# Altium schematic sheet A_D.000000.001.SchDoc: =GlobalProjectName
size 594 x 420 mm; Author: A_D; SheetTotal: 1; PageSetup: Record=PageOptions|CenterHorizontal=True|CenterVertical=True|PrintScale=0.70|XCorrection=1.00|YCorrection=1.00|PrintKind=2|BorderSize=5000000|LeftOffset=9000|BottomOffset=10100|Orientation=2|PaperLength=11176|PaperWidth=8636|Scale=100|PaperSource=259|PrintQuality=-3|MediaType=1|DitherType=10|PrintScaleMode=1|PaperKind=A3|PaperIndex=8
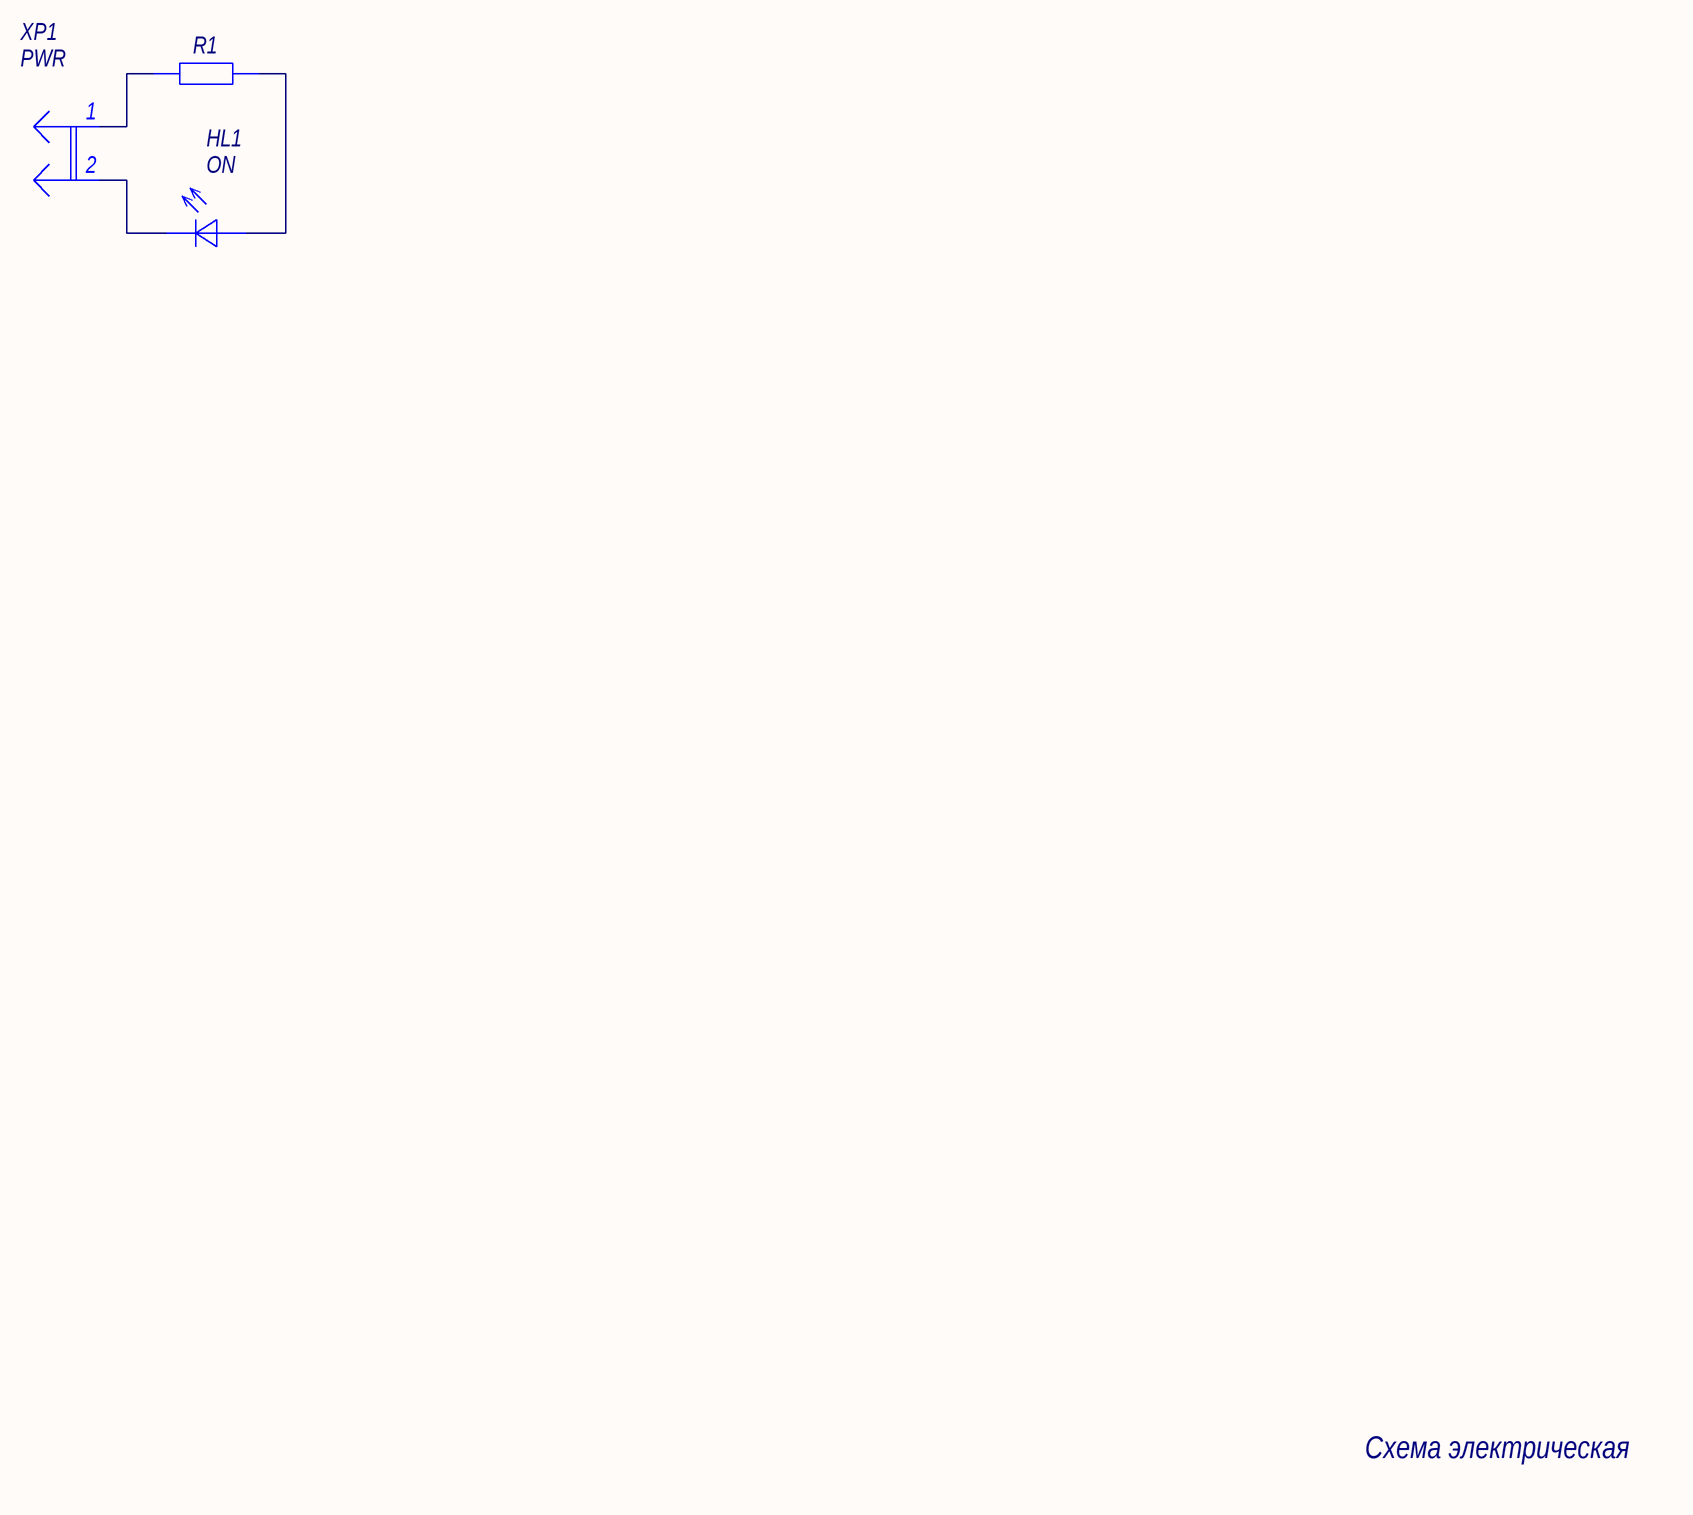
[diagram p0: A_D.000000.001.SchDoc]

## Parts
HL1  ON  [LD0603]
R1  Resistor  [R0603]  (value not drawn)
XP1  PWR  [WF-2]

## Nets
NetHL1_1: HL1.1(А) R1.2
NetHL1_2: HL1.2(К) XP1.2
NetR1_1: R1.1 XP1.1

## Notes on the sheet
- Схема электрическая
  принципиальная
- Перв. примен.
- Справ. №
- ПЗ:                             Дата
- Подп. и дата
- Инв. № дубл.
- Взам. инв. №
- Разраб.
- Изм.
- Лист
- № докум.
- Подп.
- Дата
- Литера
- Масса
- Масштаб
- Пров.
- Т.контр.
- Листов
- Инв. № подл.
- Н.контр.
- Утв.
- Форма 1 ГОСТ 2.104-2006
- Копировал
- Формат А2

## Library data of the parts
HL1 = BL-LS0603HC: Type: Индикатор единичный; ID: 13; Forward Voltage: 2.2V; Forward Current: 30mA; Power Dissipation: 65mW; Color: Red; Leds: 1; Published: 03.12.2013; Publisher: Andrew Danich; Part Number: BL-LS0603HC; Value: BL-LS0603HC; Footprint: 0603
R1 = RC0603JR-07330RL: Manufacturer: Yageo; ID: 313; Value: 330; Limit Voltage: 50V; Tolerance: ±5%; Temperature Coefficient: 100ppm; Total Power Dissipation: 0.1W; Series Type: Thick-Film; Application Category: 1; Working Temperature Min: -55°С; Working Temperature Max: +155°С; Functional Analog: CR0603-JW-331E; Published: 24.03.2010; Publisher: Andrew Danich; Type: Резистор; Part Number: RC0603JR-07330RL; Footprint: 0603
XP1 = WF-2: Manufacturer: Ningbo Zhenqin Electronic; Value: WF-2; ID: 70; Limit Voltage: 250V; Limit Current: 3A; Connector Type: Male; Resistance: 0.2ohm; Surface Finish: Phosphor Bronze; Pitch: 2.54mm; Application Category: 1; Working Temperature Min: -30°С; Working Temperature Max: +90°С; Functional Analog: DS1070-2MVV6; Published: 07.03.2013; Publisher: Andrew Danich; Type: Вилка; Part Number: WF-2; Pins: 2